# EAGLE design LowTemp_board_2 (EAGLE 6.4)
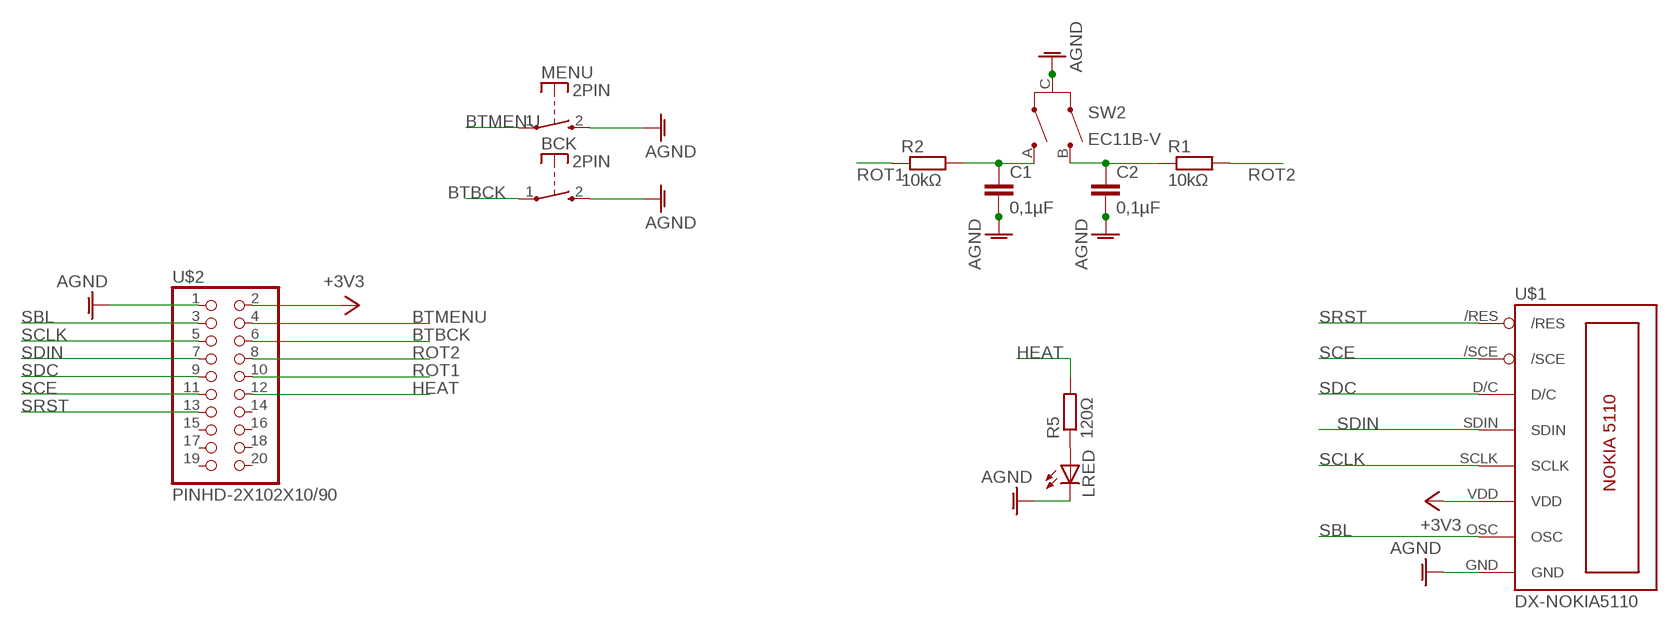
[diagram p0: schematic, sheet 1]

## Parts
BCK  2PIN  [2PIN]
C1  0,1µF  C-EU050-025X075  [C050-025X075]
C2  0,1µF  C-EU050-025X075  [C050-025X075]
LRED  LED5MM  [LED5MM]
MENU  2PIN  [2PIN]
R1  10kΩ  R-EU_0207/7  [0207/7]
R2  10kΩ  R-EU_0207/7  [0207/7]
R5  120Ω  R-EU_0207/7  [0207/7]
SW2  EC11B-V  [EC11B-V]
U$1  DX-NOKIA5110  [DX-NOKIA5110]
U$2  PINHD-2X102X10/90  [2X10/90]

## Nets
+3V3: U$1.VDD U$2.2
AGND: BCK.2(S) C1.2 C2.2 LRED.K(C) MENU.2(S) SW2.C U$1.GND U$2.1
BTBCK: BCK.1(P) U$2.6
BTMENU: MENU.1(P) U$2.4
HEAT: R5.2 U$2.12
N$1: C1.1 R2.2 SW2.A
N$2: C2.1 R1.1 SW2.B
N$4: LRED.A R5.1
ROT1: R2.1 U$2.10
ROT2: R1.2 U$2.8
SBL: U$1.OSC U$2.3
SCE: U$1./SCE U$2.11
SCLK: U$1.SCLK U$2.5
SDC: U$1.D/C U$2.9
SDIN: U$1.SDIN U$2.7
SRST: U$1./RES U$2.13
Unconnected: U$2.14 U$2.15 U$2.16 U$2.17 U$2.18 U$2.19 U$2.20

## Library data of the parts
BCK MENU = switch-misc:2PIN
C1 C2 = rcl:C-EU: CAPACITOR, European symbol
LRED = led:LED: LED OSRAM: - CHIPLED LG R971, LG N971, LY N971, LG Q971, LY Q971, LO R971, LY R971 LH N974, LH R974 LS Q976, LO Q976, LY Q976 LO Q996 - Hyper CHIPLED LW Q18S LB Q993, LB Q99A, LB R99A - SideLED LS A670, LO A670, LY A670, LG A670, LP A670 LB A673, LV A673, LT A673, LW A673 LH A674 LY A675 LS A676, LA A676, LO A676, LY A676, LW A676 LS A679, LY A679, LG A679 - Hyper Micro SIDELED® LS Y876, LA Y876, LO Y876, LY Y876 LT Y87S - SmartLED LW L88C, LW L88S LB L89C, LB L89S, LG L890 LS L89K, LO L89K, LY L89K LS L896, LA L896, LO L896, LY L896 - TOPLED LS T670, LO T670, LY T670, LG T670, LP T670 LSG T670, LSP T670, LSY T670, LOP T670, LYG T670 LG T671, LOG T671, LSG T671 LB T673, LV T673, LT T673, LW T673 LH T674 LS T676, LA T676, LO T676, LY T676, LB T676, LH T676, LSB T676, LW T676 LB T67C, LV T67C, LT T67C, LS T67K, LO T67K, LY T67K, LW E67C LS E67B, LA E67B, LO E67B, LY E67B, LB E67C, LV E67C, LT E67C LW T67C LS T679, LY T679, LG T679 LS T770, LO T770, LY T770, LG T770, LP T770 LB T773, LV T773, LT T773, LW T773 LH T774 LS E675, LA E675, LY E675, LS T675 LS T776, LA T776, LO T776, LY T776, LB T776 LHGB T686 LT T68C, LB T68C - Hyper Mini TOPLED® LB M676 - Mini TOPLED Santana® LG M470 LS M47K, LO M47K, LY M47K Source: http://www.osram.convergy.de LUXEON: - LUMILED® LXK2-PW12-R00, LXK2-PW12-S00, LXK2-PW14-U00, LXK2-PW14-V00 LXK2-PM12-R00, LXK2-PM12-S00, LXK2-PM14-U00 LXK2-PE12-Q00, LXK2-PE12-R00, LXK2-PE12-S00, LXK2-PE14-T00, LXK2-PE14-U00 LXK2-PB12-K00, LXK2-PB12-L00, LXK2-PB12-M00, LXK2-PB14-N00, LXK2-PB14-P00, LXK2-PB14-Q00 LXK2-PR12-L00, LXK2-PR12-M00, LXK2-PR14-Q00, LXK2-PR14-R00 LXK2-PD12-Q00, LXK2-PD12-R00, LXK2-PD12-S00 LXK2-PH12-R00, LXK2-PH12-S00 LXK2-PL12-P00, LXK2-PL12-Q00, LXK2-PL12-R00 Source: www.luxeon.com KINGBRIGHT: KA-3528ASYC Source: www.kingbright.com
R1 R2 R5 = resistor:R-EU_: RESISTOR, European symbol
SW2 = alps:EC11B-V: ALPS EC11B Vertikal Ohne Taster Drehimpulsgeber 11 mm
U$1 = lph-7366:DX-NOKIA5110
U$2 = adafruit:PINHD-2X10

## Board
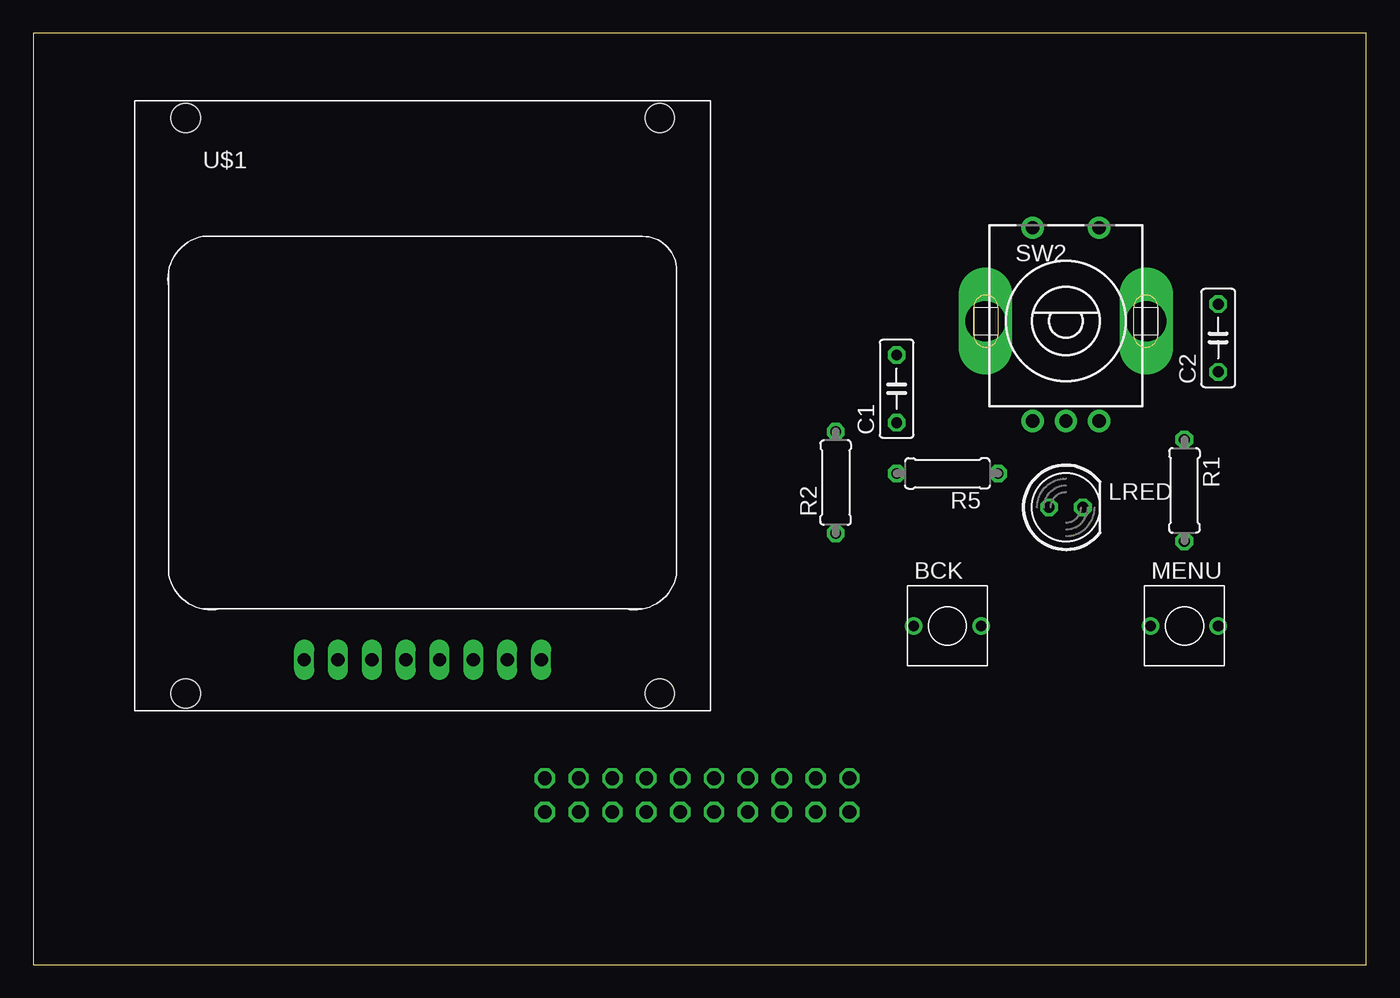
[diagram p1: board, top side]
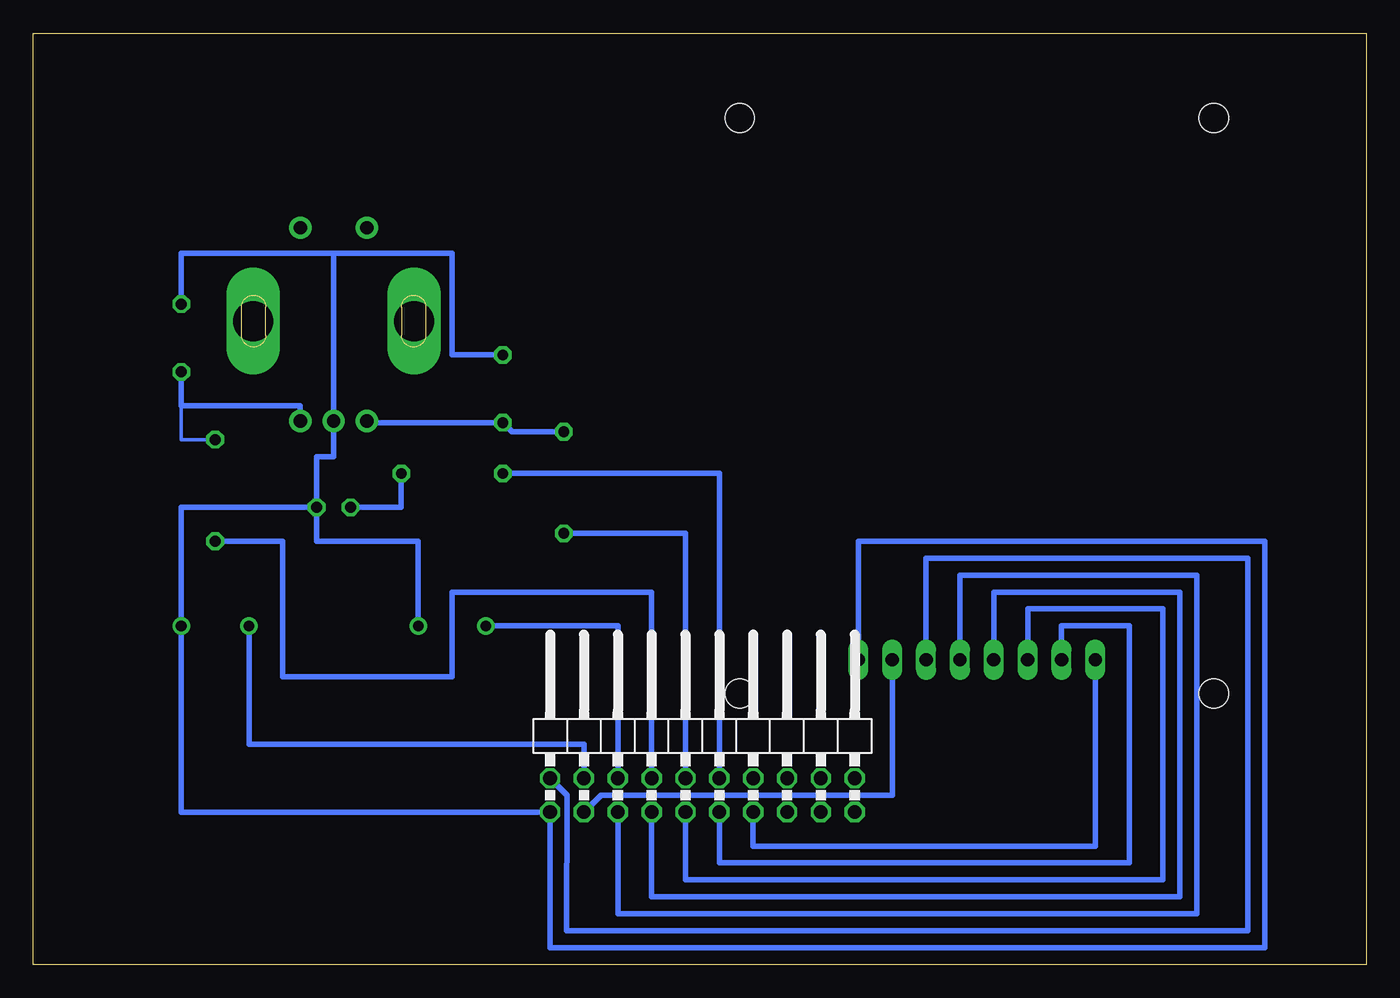
[diagram p2: board, bottom side, seen from below]

Size 100 x 69.84 mm. Coordinates in mm from the lower left corner, seen from the top.
Outline: 0,0 100,0 100,69.84 0,69.84 0,0
Copper layers (1*16): Top 0.035mm / dielectric 1.5mm / Bottom 0.035mm
Design rules "default": minimum track width 10mil, minimum drill 24mil, track to track 8mil, track to pad 8mil, pad to pad 8mil, via to via 8mil, smd to smd 8mil, copper to edge 40mil, drill to drill 8mil, minimum pad ring 10mil, minimum via ring 8mil, stop-mask expansion 4mil, vias tented up to drill 0mil, thermal gap 10mil

### Footprints (pad centres in the part's own frame; a part is rotated, then mirrored left to right if it is on the bottom)
2PIN = drill 0.8: 1 -2.54,0; 2 2.54,0
C050-025X075 = drill 0.813 octagon: 1 -2.54,0; 2 2.54,0
LED5MM = drill 0.813 octagon: A -1.27,0; K 1.27,0
0207/7 = drill 0.813 octagon: 1 -3.81,0; 2 3.81,0
EC11B-V = drill 1 pad 1.676: A -2.5,-7.5; B 2.5,-7.5; C 0,-7.5; D -2.5,7; E 2.5,7 | drill 3 pad 3.3 long: G1 -6.032,0; G2 6.032,0
DX-NOKIA5110 = drill 1 long: /RES -8.89,-17.78; /SCE -6.35,-17.78; D/C -3.81,-17.78; GND 8.89,-17.78; OSC 6.35,-17.78; SCLK 1.27,-17.78; SDIN -1.27,-17.78; VDD 3.81,-17.78 | hole 2.2: -17.78,-20.32; 17.78,-20.32; 17.78,22.86; -17.78,22.86
2X10/90 = drill 1.016 octagon: 1 -11.43,-5.08; 2 -11.43,-2.54; 3 -8.89,-5.08; 4 -8.89,-2.54; 5 -6.35,-5.08; 6 -6.35,-2.54; 7 -3.81,-5.08; 8 -3.81,-2.54; 9 -1.27,-5.08; 10 -1.27,-2.54; 11 1.27,-5.08; 12 1.27,-2.54; 13 3.81,-5.08; 14 3.81,-2.54; 15 6.35,-5.08; 16 6.35,-2.54; 17 8.89,-5.08; 18 8.89,-2.54; 19 11.43,-5.08; 20 11.43,-2.54

### Placement (x,y rotation side)
BCK  68.58,25.4 0 top
C1  64.77,43.18 90 top
C2  88.9,46.99 90 top
LRED  77.47,34.29 0 top
MENU  86.36,25.4 0 top
R1  86.36,35.56 270 top
R2  60.2,36.15 90 top
R5  68.58,36.83 180 top
SW2  77.47,48.26 0 top
U$1  29.21,40.64 0 top
U$2  49.8,16.51 0 bottom

### Tracks (layer width: path | path; a pad name or v marks a point on that pad's centre or on a via)
+3V3
  Bottom 0.406: U$2.2 59.96,12.7 59.99,2.54 8.89,2.54 8.89,30.48 33.02,30.48 U$1.VDD
AGND
  Bottom 0.406: LRED.K 88.9,34.29 MENU.2 88.9,11.43 U$2.1 61.23,1.27 7.62,1.27 7.62,31.75 38.1,31.75 U$1.GND | 77.47,53.34 SW2.C 77.47,38.1 78.74,38.1 LRED.K | 77.47,53.34 88.9,53.34 C2.2 | C1.2 68.58,45.72 68.58,53.34 77.47,53.34 | BCK.2 71.12,31.75 78.74,31.75 LRED.K
BTBCK
  Bottom 0.406: BCK.1 56.15,25.4 U$2.6
BTMENU
  Bottom 0.406: U$2.4 58.69,16.51 83.82,16.51 MENU.1
HEAT
  Bottom 0.406: U$2.12 48.53,36.83 R5.2
N$1
  Bottom 0.406: R2.2 64.09,39.96 C1.1 74.85,40.64 SW2.A
N$2
  Bottom 0.254: R1.1 88.9,39.37 88.9,41.91
  Bottom 0.406: C2.1 88.9,41.91 79.97,41.91 SW2.B
N$4
  Bottom 0.406: R5.1 72.39,34.29 LRED.A
ROT1
  Bottom 0.406: U$2.10 51.06,32.36 R2.1
ROT2
  Bottom 0.406: U$2.8 53.61,27.94 68.58,27.94 68.58,21.59 81.28,21.59 81.28,31.75 R1.2
SBL
  Bottom 0.406: U$2.3 57.42,12.7 35.56,12.7 U$1.OSC
SCE
  Bottom 0.406: U$2.11 48.53,7.62 17.78,7.62 17.78,25.4 22.86,25.4 U$1./SCE
SCLK
  Bottom 0.406: U$2.5 56.15,3.81 12.7,3.81 12.7,29.21 30.48,29.21 U$1.SCLK
SDC
  Bottom 0.406: U$1.D/C 25.4,26.67 15.24,26.67 15.24,6.35 51.07,6.35 U$2.9
SDIN
  Bottom 0.406: U$1.SDIN 27.94,27.94 13.97,27.94 13.97,5.08 53.61,5.08 U$2.7
SRST
  Bottom 0.406: U$1./RES 20.32,8.89 45.99,8.89 U$2.13